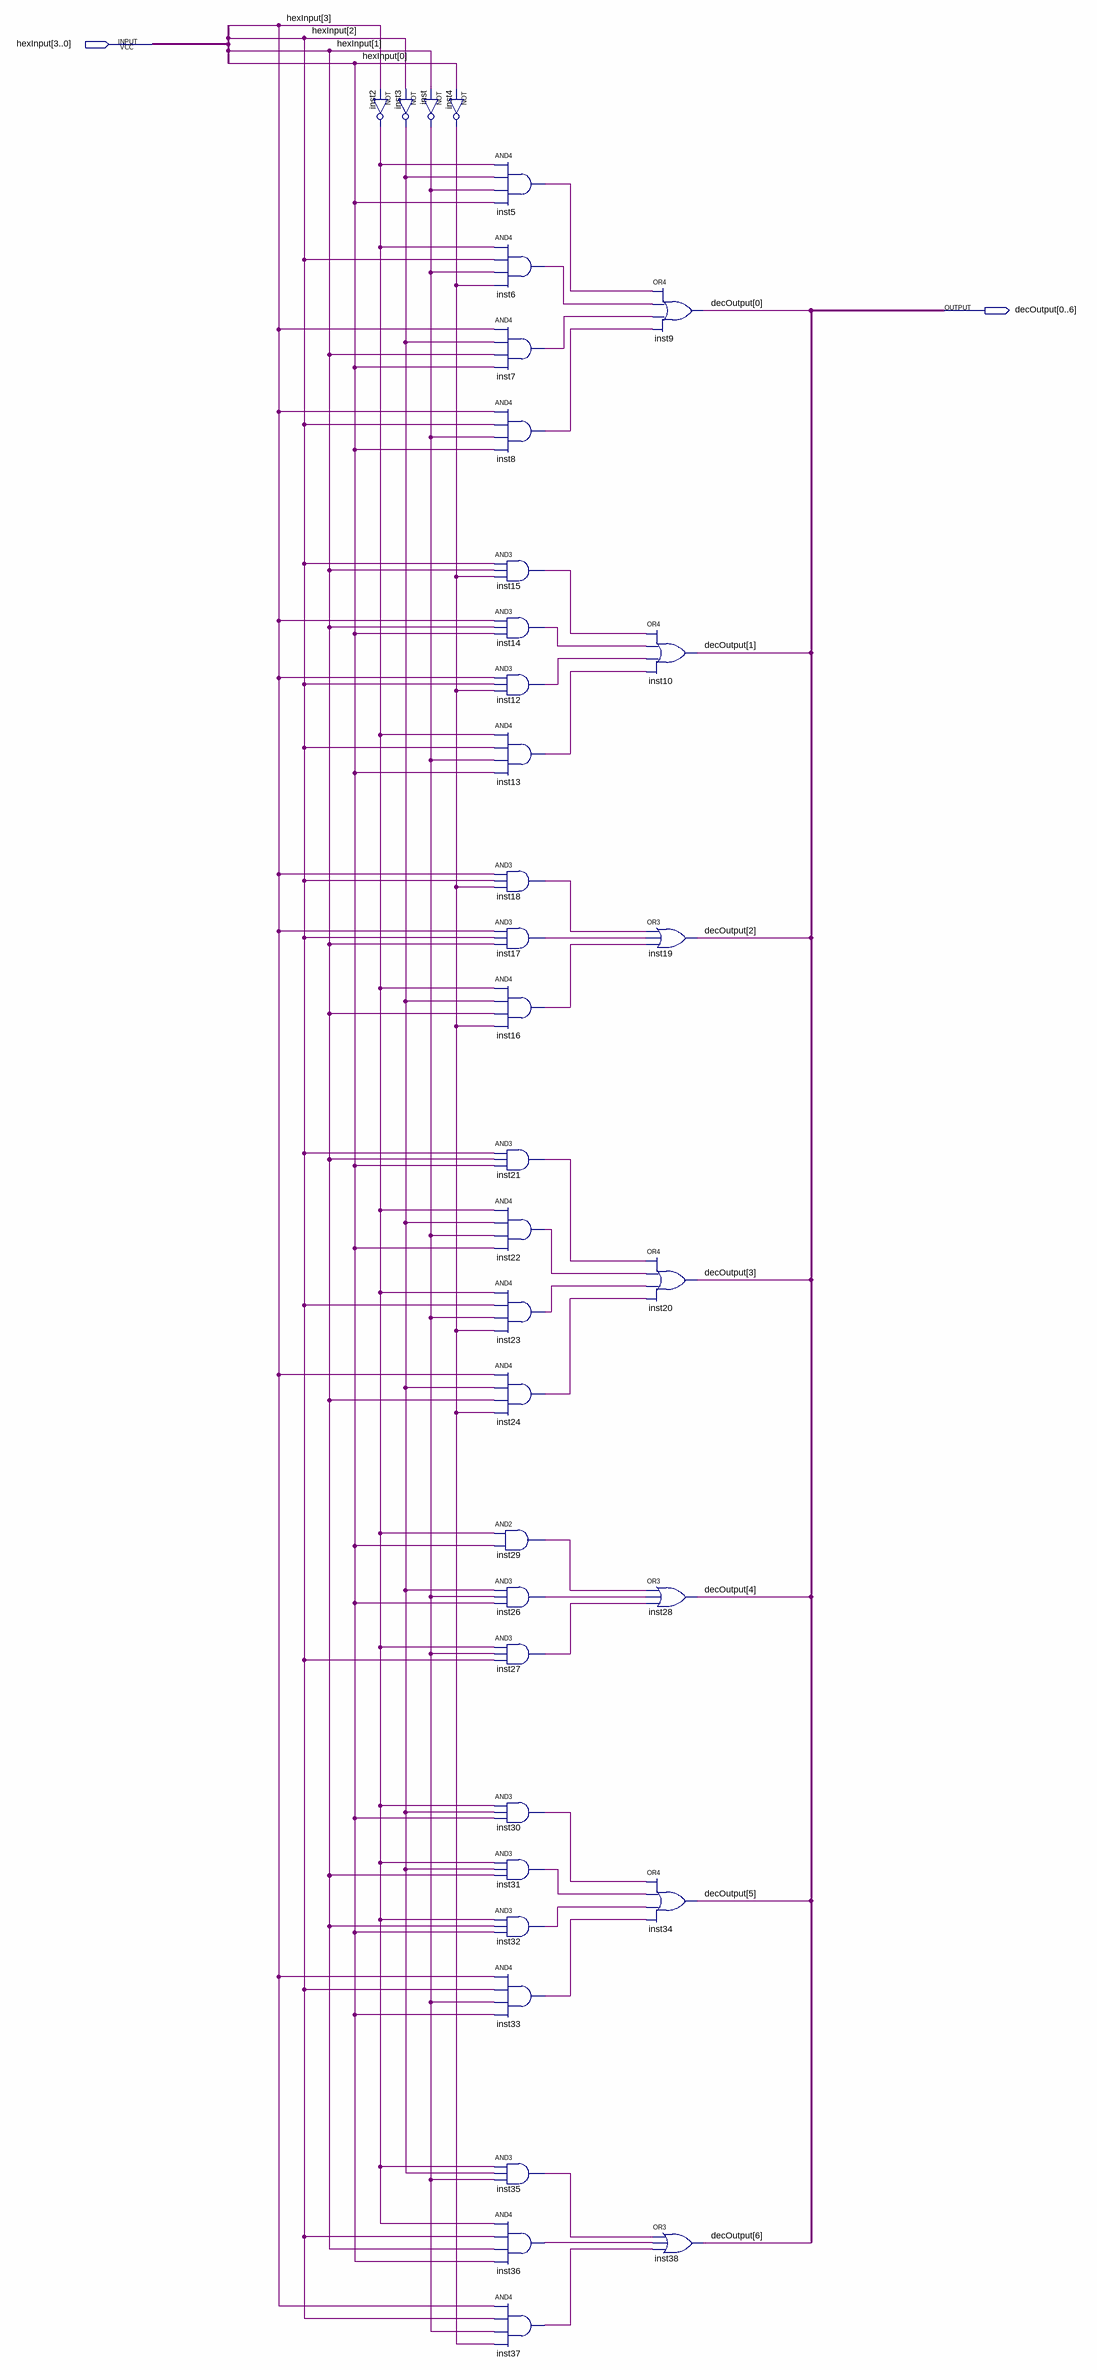
[diagram p0: schematic sheet]
// Quartus schematic Hex.bdf as structural Verilog: 36 symbols, 2 pins
module Hex (
  input  [3:0] hexInput,
  output [0:6] decOutput
);

  wire inst2_out, inst3_out, inst4_out, inst5_out, inst6_out, inst7_out, inst8_out, inst12_out, inst13_out,
       inst14_out, inst15_out, inst16_out, inst17_out, inst18_out, inst21_out, inst22_out, inst23_out,
       inst24_out, inst26_out, inst27_out, inst29_out, inst30_out, inst31_out, inst32_out, inst33_out,
       inst35_out, inst36_out, inst37_out, inst_out;

  not inst2 (inst2_out, hexInput[3]);
  not inst3 (inst3_out, hexInput[2]);
  not inst (inst_out, hexInput[1]);
  not inst4 (inst4_out, hexInput[0]);
  and inst5 (inst5_out, inst2_out, inst3_out, inst_out, hexInput[0]);
  and inst6 (inst6_out, inst2_out, hexInput[2], inst_out, inst4_out);
  and inst7 (inst7_out, hexInput[3], inst3_out, hexInput[1], hexInput[0]);
  and inst8 (inst8_out, hexInput[3], hexInput[2], inst_out, hexInput[0]);
  and inst15 (inst15_out, hexInput[2], hexInput[1], inst4_out);
  and inst14 (inst14_out, hexInput[3], hexInput[1], hexInput[0]);
  and inst12 (inst12_out, hexInput[3], hexInput[2], inst4_out);
  and inst13 (inst13_out, inst2_out, hexInput[2], inst_out, hexInput[0]);
  and inst18 (inst18_out, hexInput[3], hexInput[2], inst4_out);
  and inst17 (inst17_out, hexInput[3], hexInput[2], hexInput[1]);
  and inst16 (inst16_out, inst2_out, inst3_out, hexInput[1], inst4_out);
  and inst21 (inst21_out, hexInput[2], hexInput[1], hexInput[0]);
  and inst22 (inst22_out, inst2_out, inst3_out, inst_out, hexInput[0]);
  and inst23 (inst23_out, inst2_out, hexInput[2], inst_out, inst4_out);
  and inst24 (inst24_out, hexInput[3], inst3_out, hexInput[1], inst4_out);
  and inst29 (inst29_out, inst2_out, hexInput[0]);
  and inst26 (inst26_out, inst3_out, inst_out, hexInput[0]);
  and inst27 (inst27_out, inst2_out, inst_out, hexInput[2]);
  and inst30 (inst30_out, inst2_out, inst3_out, hexInput[0]);
  and inst31 (inst31_out, inst2_out, inst3_out, hexInput[1]);
  and inst32 (inst32_out, inst2_out, hexInput[1], hexInput[0]);
  and inst33 (inst33_out, hexInput[3], hexInput[2], inst_out, hexInput[0]);
  and inst35 (inst35_out, inst2_out, inst3_out, inst_out);
  and inst36 (inst36_out, inst2_out, hexInput[2], hexInput[1], hexInput[0]);
  and inst37 (inst37_out, hexInput[3], hexInput[2], inst_out, inst4_out);
  or inst9 (decOutput[0], inst5_out, inst6_out, inst7_out, inst8_out);
  or inst10 (decOutput[1], inst15_out, inst14_out, inst12_out, inst13_out);
  or inst19 (decOutput[2], inst18_out, inst17_out, inst16_out);
  or inst20 (decOutput[3], inst21_out, inst22_out, inst23_out, inst24_out);
  or inst28 (decOutput[4], inst29_out, inst26_out, inst27_out);
  or inst34 (decOutput[5], inst30_out, inst31_out, inst32_out, inst33_out);
  or inst38 (decOutput[6], inst35_out, inst36_out, inst37_out);
endmodule
